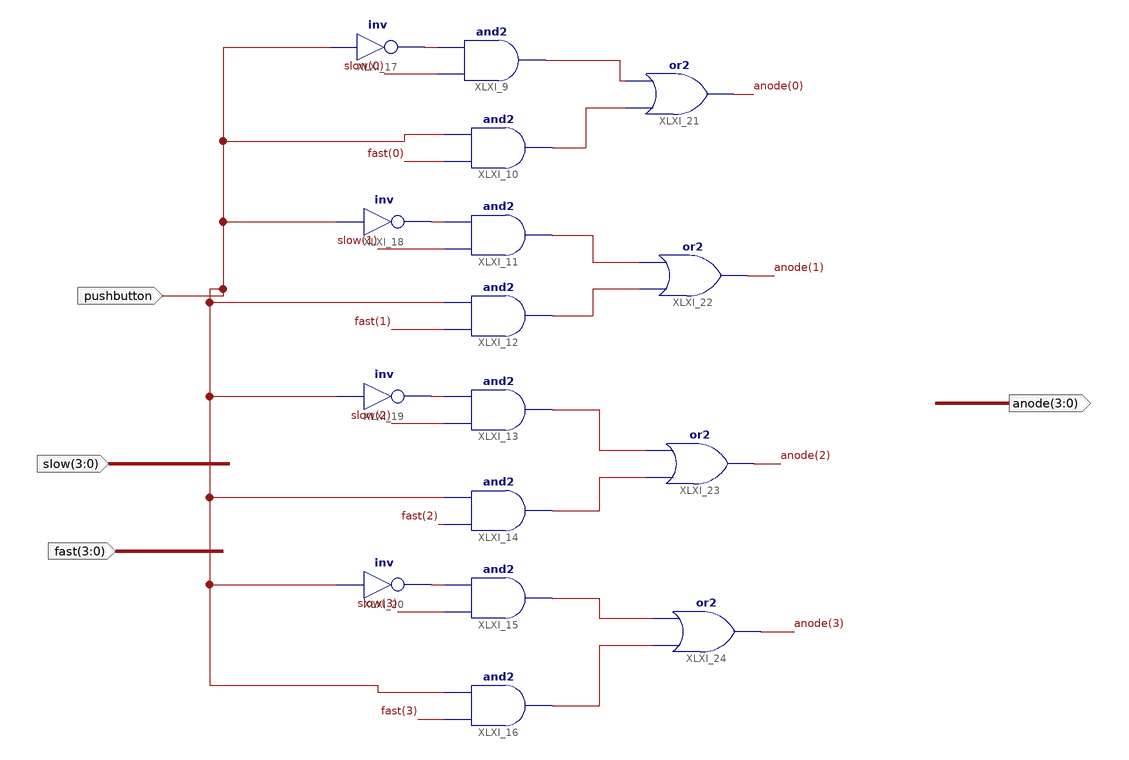
[diagram p0: schematic sheet 1]
// Xilinx ISE schematic mux8_4.sch (artix7) as structural Verilog: 16 symbols, 4 ports
module mux8_4 (
  input  [3:0] slow,
  input  [3:0] fast,
  input  pushbutton,
  output [3:0] anode
);

  wire XLXN_4, XLXN_5, XLXN_6, XLXN_7, XLXN_26, XLXN_27, XLXN_28, XLXN_29, XLXN_30, XLXN_31, XLXN_32, XLXN_33;

  and XLXI_9 (XLXN_26, slow[0], XLXN_4);
  and XLXI_10 (XLXN_27, fast[0], pushbutton);
  and XLXI_11 (XLXN_28, slow[1], XLXN_5);
  and XLXI_12 (XLXN_29, fast[1], pushbutton);
  and XLXI_13 (XLXN_30, slow[2], XLXN_6);
  and XLXI_14 (XLXN_31, fast[2], pushbutton);
  and XLXI_15 (XLXN_32, slow[3], XLXN_7);
  and XLXI_16 (XLXN_33, fast[3], pushbutton);
  not XLXI_17 (XLXN_4, pushbutton);
  not XLXI_18 (XLXN_5, pushbutton);
  not XLXI_19 (XLXN_6, pushbutton);
  not XLXI_20 (XLXN_7, pushbutton);
  or XLXI_21 (anode[0], XLXN_27, XLXN_26);
  or XLXI_22 (anode[1], XLXN_29, XLXN_28);
  or XLXI_23 (anode[2], XLXN_31, XLXN_30);
  or XLXI_24 (anode[3], XLXN_33, XLXN_32);
endmodule
